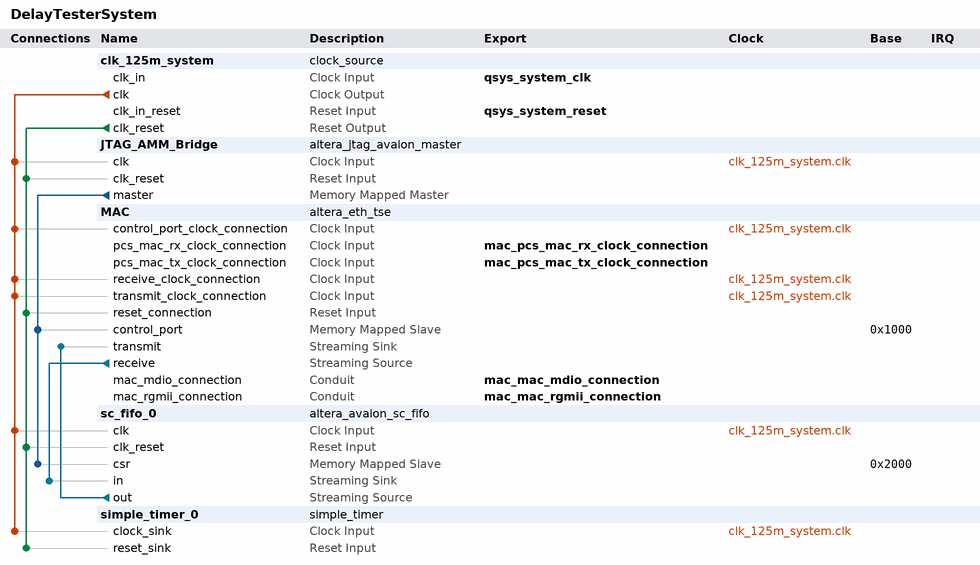
[diagram p0: system contents]
# Platform Designer (Qsys) system DelayTesterSystem, Cyclone V 5CSEBA4U19C8
# Parameters at their usual value, and those the tool derives, are not listed.
package require -exact qsys 16.1
create_system DelayTesterSystem
set_project_property DEVICE_FAMILY {Cyclone V}
set_project_property DEVICE 5CSEBA4U19C8

add_instance clk_125m_system clock_source 16.1
set_instance_parameter_value clk_125m_system clockFrequency 250000000

add_instance JTAG_AMM_Bridge altera_jtag_avalon_master 16.1

add_instance MAC altera_eth_tse 16.1
set_instance_parameter_value MAC core_variation MAC_ONLY
set_instance_parameter_value MAC eg_addr 6
set_instance_parameter_value MAC enable_gmii_loopback true
set_instance_parameter_value MAC enable_hd_logic false
set_instance_parameter_value MAC enable_mac_flow_ctrl false
set_instance_parameter_value MAC enable_magic_detect false
set_instance_parameter_value MAC enable_shift16 true
set_instance_parameter_value MAC ext_stat_cnt_ena true
set_instance_parameter_value MAC ifGMII RGMII
set_instance_parameter_value MAC ing_addr 6
set_instance_parameter_value MAC mdio_clk_div 40
set_instance_parameter_value MAC stat_cnt_ena true
set_instance_parameter_value MAC transceiver_type NONE

add_instance sc_fifo_0 altera_avalon_sc_fifo 16.1
set_instance_parameter_value sc_fifo_0 BITS_PER_SYMBOL 8
set_instance_parameter_value sc_fifo_0 CHANNEL_WIDTH 0
set_instance_parameter_value sc_fifo_0 ERROR_WIDTH 0
set_instance_parameter_value sc_fifo_0 FIFO_DEPTH 512
set_instance_parameter_value sc_fifo_0 SYMBOLS_PER_BEAT 4
set_instance_parameter_value sc_fifo_0 USE_FILL_LEVEL 1
set_instance_parameter_value sc_fifo_0 USE_MEMORY_BLOCKS 1
set_instance_parameter_value sc_fifo_0 USE_PACKETS 1
set_instance_parameter_value sc_fifo_0 USE_STORE_FORWARD 1

add_instance simple_timer_0 simple_timer 1.0
set_instance_parameter_value simple_timer_0 WIDTH 32

# connections
add_connection clk_125m_system.clk JTAG_AMM_Bridge.clk clock
add_connection clk_125m_system.clk MAC.control_port_clock_connection clock
add_connection clk_125m_system.clk MAC.receive_clock_connection clock
add_connection clk_125m_system.clk MAC.transmit_clock_connection clock
add_connection clk_125m_system.clk sc_fifo_0.clk clock
add_connection clk_125m_system.clk simple_timer_0.clock_sink clock
add_connection clk_125m_system.clk_reset JTAG_AMM_Bridge.clk_reset reset
add_connection clk_125m_system.clk_reset MAC.reset_connection reset
add_connection clk_125m_system.clk_reset sc_fifo_0.clk_reset reset
add_connection clk_125m_system.clk_reset simple_timer_0.reset_sink reset
add_connection JTAG_AMM_Bridge.master MAC.control_port avalon
set_connection_parameter_value JTAG_AMM_Bridge.master/MAC.control_port baseAddress 0x1000
add_connection JTAG_AMM_Bridge.master sc_fifo_0.csr avalon
set_connection_parameter_value JTAG_AMM_Bridge.master/sc_fifo_0.csr baseAddress 0x2000
add_connection MAC.receive sc_fifo_0.in avalon_streaming
add_connection sc_fifo_0.out MAC.transmit avalon_streaming

# exported interfaces
add_interface mac_mac_mdio_connection conduit end
set_interface_property mac_mac_mdio_connection EXPORT_OF MAC.mac_mdio_connection
add_interface mac_mac_rgmii_connection conduit end
set_interface_property mac_mac_rgmii_connection EXPORT_OF MAC.mac_rgmii_connection
add_interface mac_pcs_mac_rx_clock_connection clock sink
set_interface_property mac_pcs_mac_rx_clock_connection EXPORT_OF MAC.pcs_mac_rx_clock_connection
add_interface mac_pcs_mac_tx_clock_connection clock sink
set_interface_property mac_pcs_mac_tx_clock_connection EXPORT_OF MAC.pcs_mac_tx_clock_connection
add_interface qsys_system_clk clock sink
set_interface_property qsys_system_clk EXPORT_OF clk_125m_system.clk_in
add_interface qsys_system_reset reset sink
set_interface_property qsys_system_reset EXPORT_OF clk_125m_system.clk_in_reset

set_interconnect_requirement {$system} qsys_mm.clockCrossingAdapter HANDSHAKE
set_interconnect_requirement {$system} qsys_mm.maxAdditionalLatency 1

save_system DelayTesterSystem.qsys
